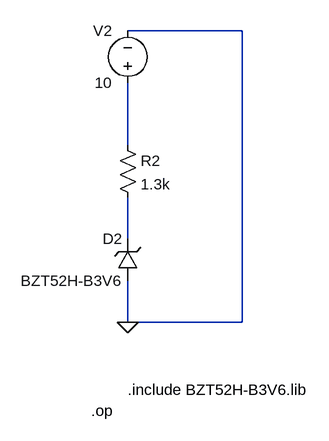
[diagram p0: schematic Zener_Test.asc]
Zener_Test.asc, the LTspice schematic file:
Version 4.1
SHEET 1 880 680
WIRE 576 -688 400 -688
WIRE 400 -512 400 -608
WIRE 400 -368 400 -432
WIRE 400 -240 400 -304
WIRE 576 -240 576 -688
WIRE 576 -240 400 -240
FLAG 400 -240 0
SYMBOL zener 416 -304 R180
WINDOW 0 24 64 Left 2
WINDOW 3 24 0 Left 2
SYMATTR InstName D2
SYMATTR Value BZT52H-B3V6
SYMATTR Prefix X
SYMBOL res 384 -528 R0
SYMATTR InstName R2
SYMATTR Value 1.3k
SYMBOL voltage 400 -592 R180
WINDOW 0 24 96 Left 2
WINDOW 3 24 16 Left 2
WINDOW 123 0 0 Left 0
WINDOW 39 0 0 Left 0
SYMATTR InstName V2
SYMATTR Value 10
TEXT 400 -136 Left 2 !.include BZT52H-B3V6.lib
TEXT 344 -104 Left 2 !.op

The netlist it stands for:
* Zener_Test.asc
X§D2 0 N002 BZT52H-B3V6  ; pins + -
R2 N001 N002 1.3k
V2 N001 0 10
.include BZT52H-B3V6.lib
.op
.backanno
.end